# Altium schematic sheet ZYZB010.SchDoc
size C; SheetNumber: 0; SheetTotal: 0
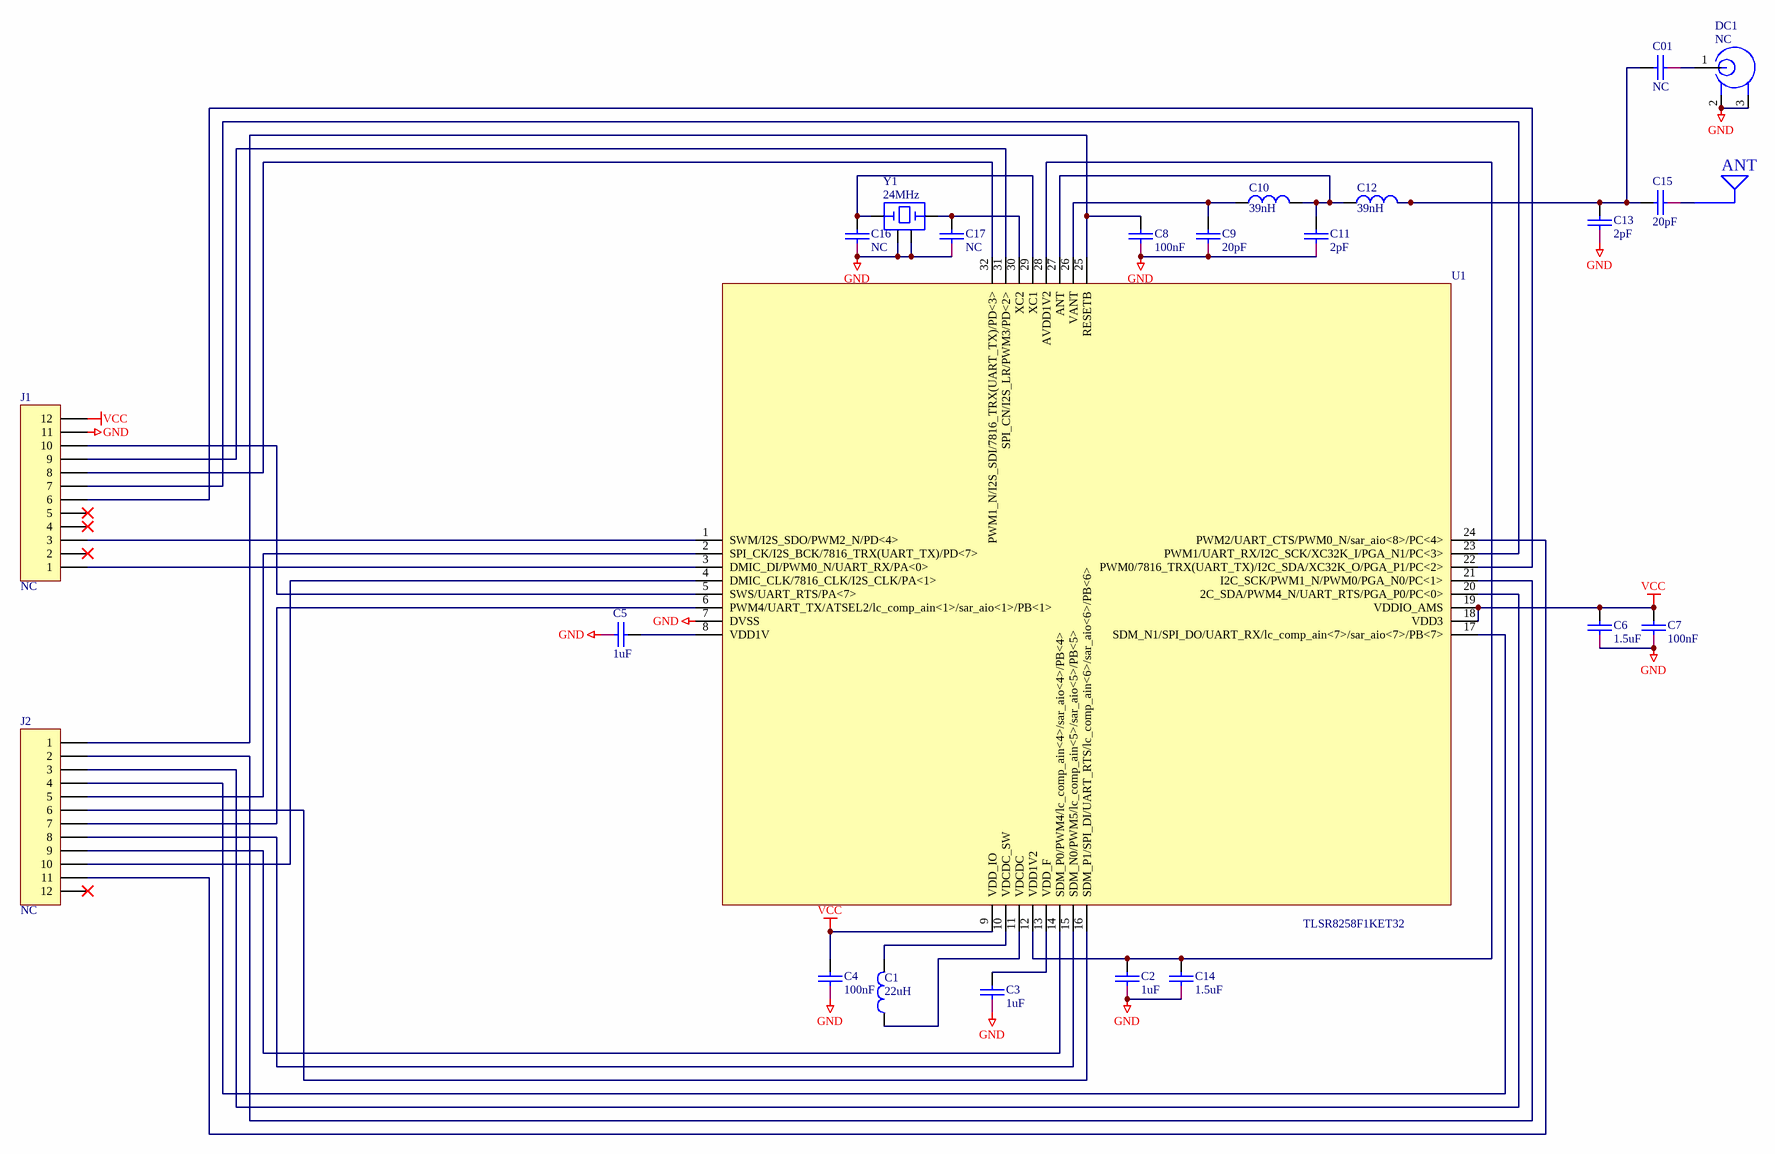
[diagram p0: ZYZB010.SchDoc]

## Parts
C1  22uH  [COMPONENT_3]
C01  NC  [01]
C2  1uF  [COMPONENT_2]
C3  1uF  [COMPONENT_2]
C4  100nF  [COMPONENT_2]
C5  1uF  [COMPONENT_2]
C6  1.5uF  [COMPONENT_2]
C7  100nF  [COMPONENT_2]
C8  100nF  [COMPONENT_2]
C9  20pF  [COMPONENT_2]
C10  39nH  [COMPONENT_2]
C11  2pF  [COMPONENT_2]
C12  39nH  [COMPONENT_2]
C13  2pF  [COMPONENT_2]
C14  1.5uF  [COMPONENT_2]
C15  20pF  [COMPONENT_2]
C16  NC  [COMPONENT_2]
C17  NC  [COMPONENT_2]
DC1  NC  [COMPONENT_5]
J1  NC  [COMPONENT_6]
J2  NC  [COMPONENT_6]
U1  TLSR8258F1KET32  [COMPONENT_1]
Y1  24MHz  [COMPONENT_4]

## Nets
GND: C2.2 C3.2 C4.2 C5.2 C6.2 C7.2 C8.2 C9.2 C11.2 C13.2 C14.2 C16.2 C17.2 DC1.2 DC1.3 J1.11 U1.7(DVSS) Y1.2 Y1.4
VCC: C4.1 C6.1 C7.1 J1.12 U1.9(VDD_IO) U1.18(VDD3) U1.19(VDDIO_AMS)
NetC01_1: C01.1 C12.2 C13.1 C15.1
NetC1_1: C1.1 U1.10(VDCDC_SW)
NetC1_2: C1.2 U1.11(VDCDC)
NetC01_2: C01.2 DC1.1
NetC2_1: C2.1 C14.1 U1.12(VDD1V2) U1.28(AVDD1V2)
NetC3_1: C3.1 U1.13(VDD_F)
NetC5_1: C5.1 U1.8(VDD1V)
NetC8_1: C8.1 J2.1 U1.25(RESETB)
NetC9_1: C9.1 C10.1 U1.26(VANT)
NetC10_2: C10.2 C11.1 C12.1 U1.27(ANT)
NetC16_1: C16.1 U1.29(XC1) Y1.3
NetC17_1: C17.1 U1.30(XC2) Y1.1
NetJ1_1: J1.1 U1.3(DMIC_DI/PWM0_N/UART_RX/PA<0>)
NetJ1_3: J1.3 U1.1(SWM/I2S_SDO/PWM2_N/PD<4>)
NetJ1_6: J1.6 U1.22(PWM0/7816_TRX(UART_TX)/I2C_SDA/XC32K_O/PGA_P1/PC<2>)
NetJ1_7: J1.7 U1.23(PWM1/UART_RX/I2C_SCK/XC32K_I/PGA_N1/PC<3>)
NetJ1_8: J1.8 U1.32(PWM1_N/I2S_SDI/7816_TRX(UART_TX)/PD<3>)
NetJ1_9: J1.9 U1.31(SPI_CN/I2S_LR/PWM3/PD<2>)
NetJ1_10: J1.10 U1.5(SWS/UART_RTS/PA<7>)
NetJ2_2: J2.2 U1.21(I2C_SCK/PWM1_N/PWM0/PGA_N0/PC<1>)
NetJ2_3: J2.3 U1.20(2C_SDA/PWM4_N/UART_RTS/PGA_P0/PC<0>)
NetJ2_4: J2.4 U1.17(SDM_N1/SPI_DO/UART_RX/lc_comp_ain<7>/sar_aio<7>/PB<7>)
NetJ2_5: J2.5 U1.2(SPI_CK/I2S_BCK/7816_TRX(UART_TX)/PD<7>)
NetJ2_6: J2.6 U1.16(SDM_P1/SPI_DI/UART_RTS/lc_comp_ain<6>/sar_aio<6>/PB<6>)
NetJ2_7: J2.7 U1.6(PWM4/UART_TX/ATSEL2/lc_comp_ain<1>/sar_aio<1>/PB<1>)
NetJ2_8: J2.8 U1.15(SDM_N0/PWM5/lc_comp_ain<5>/sar_aio<5>/PB<5>)
NetJ2_9: J2.9 U1.14(SDM_P0/PWM4/lc_comp_ain<4>/sar_aio<4>/PB<4>)
NetJ2_10: J2.10 U1.4(DMIC_CLK/7816_CLK/I2S_CLK/PA<1>)
NetJ2_11: J2.11 U1.24(PWM2/UART_CTS/PWM0_N/sar_aio<8>/PC<4>)

Not connected (* = marked no-connect by the designer): C15 2; J1 2* 4* 5*; J2 12*

## Notes on the sheet
- ANT

## Library data of the parts
C1 C10 C12 = INDUCTOR
C01-C9 C11 C13-C17 = CAP: Capacitor
DC1 = SPT-3
J1 J2 = CON12: Connector
Y1 = CRYSTAL4-2